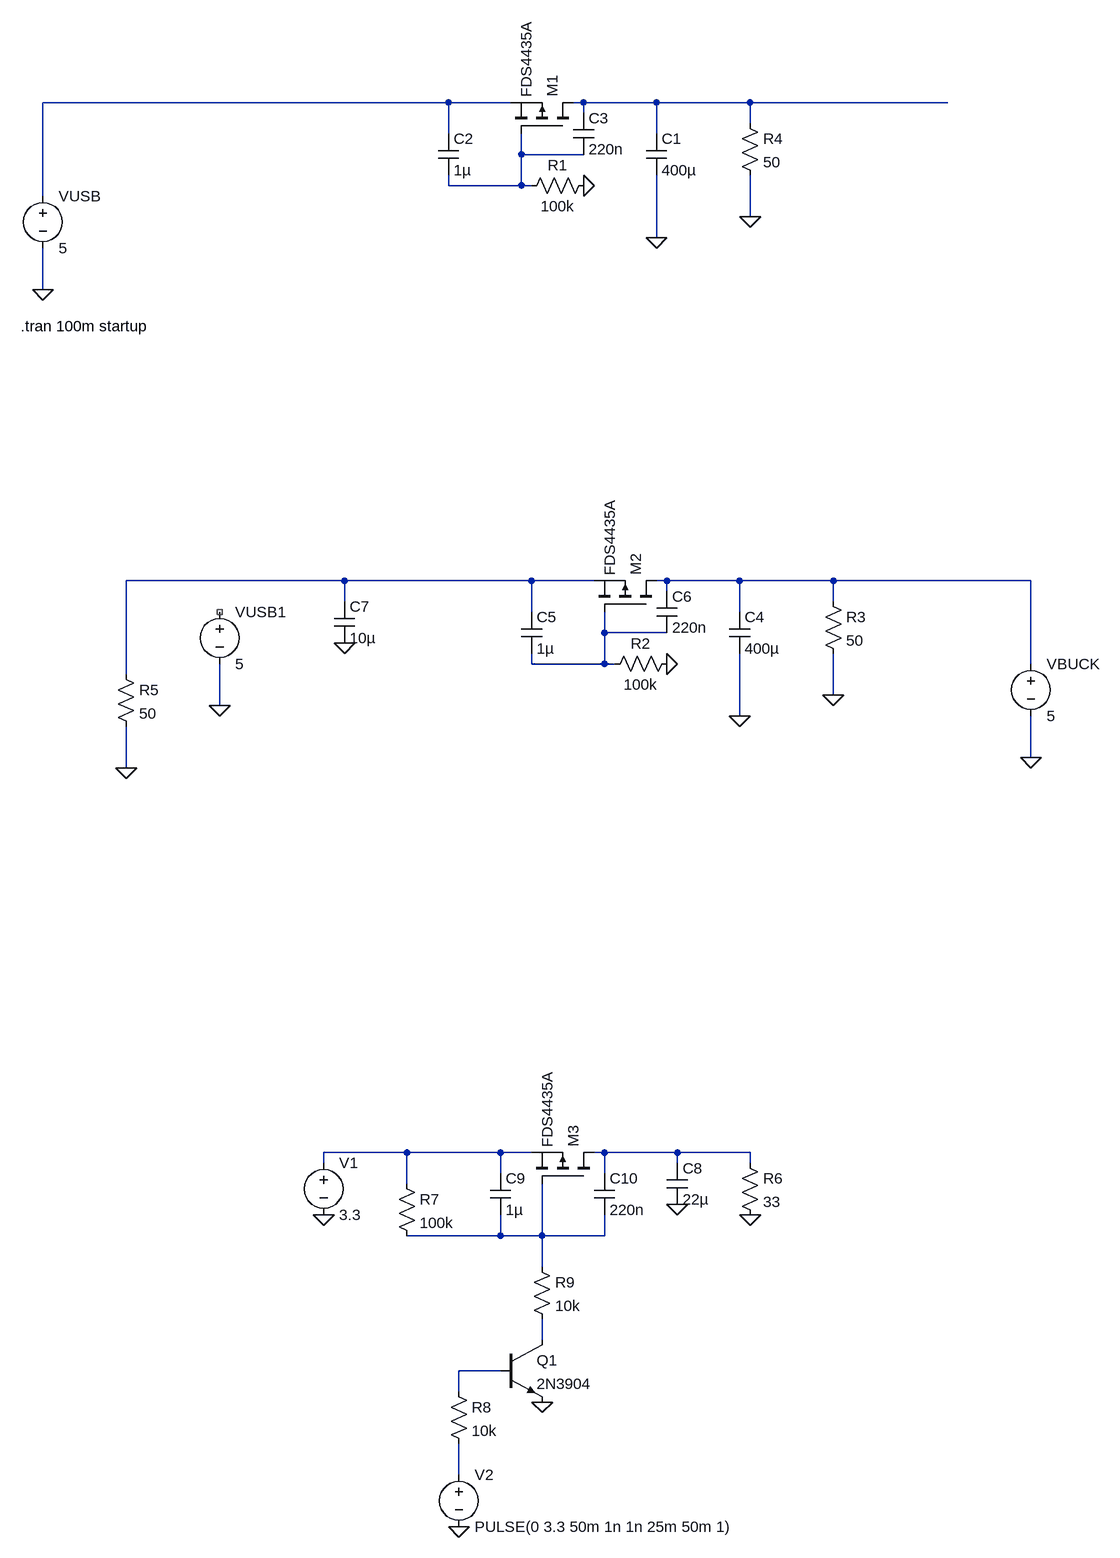
[diagram p0: schematic FMU_Inrush_Switches.asc]
FMU_Inrush_Switches.asc, the LTspice schematic file:
Version 4
SHEET 1 1056 2420
WIRE 48 208 -576 208
WIRE 144 208 48 208
WIRE 256 208 240 208
WIRE 368 208 256 208
WIRE 512 208 368 208
WIRE 816 208 512 208
WIRE 256 224 256 208
WIRE 512 240 512 208
WIRE 48 256 48 208
WIRE 368 256 368 208
WIRE 160 288 160 256
WIRE 256 288 160 288
WIRE 48 336 48 320
WIRE 160 336 160 288
WIRE 160 336 48 336
WIRE 176 336 160 336
WIRE -576 352 -576 208
WIRE 512 384 512 320
WIRE 368 416 368 320
WIRE -576 496 -576 432
WIRE -112 944 -448 944
WIRE 176 944 -112 944
WIRE 272 944 176 944
WIRE 384 944 368 944
WIRE 496 944 384 944
WIRE 640 944 496 944
WIRE 944 944 640 944
WIRE 384 960 384 944
WIRE -112 976 -112 944
WIRE 640 976 640 944
WIRE 176 992 176 944
WIRE 496 992 496 944
WIRE 288 1024 288 992
WIRE 384 1024 288 1024
WIRE 176 1072 176 1056
WIRE 288 1072 288 1024
WIRE 288 1072 176 1072
WIRE 304 1072 288 1072
WIRE 944 1072 944 944
WIRE -448 1088 -448 944
WIRE 640 1120 640 1056
WIRE -304 1136 -304 1072
WIRE 496 1152 496 1056
WIRE 944 1216 944 1152
WIRE -448 1232 -448 1168
WIRE -16 1824 -144 1824
WIRE 128 1824 -16 1824
WIRE 176 1824 128 1824
WIRE 288 1824 272 1824
WIRE 400 1824 288 1824
WIRE 512 1824 400 1824
WIRE -144 1840 -144 1824
WIRE 400 1840 400 1824
WIRE 512 1840 512 1824
WIRE 128 1856 128 1824
WIRE 288 1856 288 1824
WIRE -16 1872 -16 1824
WIRE 128 1952 128 1920
WIRE 128 1952 -16 1952
WIRE 192 1952 192 1872
WIRE 192 1952 128 1952
WIRE 288 1952 288 1920
WIRE 288 1952 192 1952
WIRE 192 2000 192 1952
WIRE 192 2112 192 2080
WIRE 128 2160 64 2160
WIRE 64 2192 64 2160
WIRE 64 2320 64 2272
FLAG -576 496 0
FLAG 944 1216 0
FLAG 368 416 0
FLAG 512 384 0
FLAG 256 336 0
FLAG -448 1232 0
FLAG 496 1152 0
FLAG 640 1120 0
FLAG 384 1072 0
FLAG -112 1040 0
FLAG 400 1904 0
FLAG 512 1920 0
FLAG 192 2208 0
FLAG -144 1920 0
FLAG 64 2400 0
FLAG -304 1136 0
SYMBOL pmos 240 256 M270
SYMATTR InstName M1
SYMATTR Value FDS4435A
SYMBOL voltage -576 336 R0
SYMATTR InstName VUSB
SYMATTR Value 5
SYMBOL voltage 944 1056 R0
SYMATTR InstName VBUCK
SYMATTR Value 5
SYMBOL cap 352 256 R0
SYMATTR InstName C1
SYMATTR Value 400µ
SYMBOL res 272 320 R90
WINDOW 0 0 56 VBottom 2
WINDOW 3 32 56 VTop 2
SYMATTR InstName R1
SYMATTR Value 100k
SYMBOL cap 32 256 R0
SYMATTR InstName C2
SYMATTR Value 1µ
SYMBOL res 496 224 R0
SYMATTR InstName R4
SYMATTR Value 50
SYMBOL cap 240 224 R0
SYMATTR InstName C3
SYMATTR Value 220n
SYMBOL pmos 368 992 M270
SYMATTR InstName M2
SYMATTR Value FDS4435A
SYMBOL cap 480 992 R0
SYMATTR InstName C4
SYMATTR Value 400µ
SYMBOL res 400 1056 R90
WINDOW 0 0 56 VBottom 2
WINDOW 3 32 56 VTop 2
SYMATTR InstName R2
SYMATTR Value 100k
SYMBOL cap 160 992 R0
SYMATTR InstName C5
SYMATTR Value 1µ
SYMBOL res 624 960 R0
SYMATTR InstName R3
SYMATTR Value 50
SYMBOL cap 368 960 R0
SYMATTR InstName C6
SYMATTR Value 220n
SYMBOL cap -128 976 R0
SYMATTR InstName C7
SYMATTR Value 10µ
SYMBOL res -464 1072 R0
SYMATTR InstName R5
SYMATTR Value 50
SYMBOL pmos 272 1872 M270
SYMATTR InstName M3
SYMATTR Value FDS4435A
SYMBOL cap 384 1840 R0
SYMATTR InstName C8
SYMATTR Value 22µ
SYMBOL res 496 1824 R0
SYMATTR InstName R6
SYMATTR Value 33
SYMBOL voltage -144 1824 R0
SYMATTR InstName V1
SYMATTR Value 3.3
SYMBOL voltage 64 2304 R0
WINDOW 123 0 0 Left 0
WINDOW 39 0 0 Left 0
SYMATTR InstName V2
SYMATTR Value PULSE(0 3.3 50m 1n 1n 25m 50m 1)
SYMBOL res -32 1856 R0
SYMATTR InstName R7
SYMATTR Value 100k
SYMBOL npn 128 2112 R0
SYMATTR InstName Q1
SYMATTR Value 2N3904
SYMBOL res 48 2176 R0
SYMATTR InstName R8
SYMATTR Value 10k
SYMBOL cap 112 1856 R0
SYMATTR InstName C9
SYMATTR Value 1µ
SYMBOL res 176 1984 R0
SYMATTR InstName R9
SYMATTR Value 10k
SYMBOL cap 272 1856 R0
SYMATTR InstName C10
SYMATTR Value 220n
SYMBOL voltage -304 976 R0
SYMATTR InstName VUSB1
SYMATTR Value 5
TEXT -610 552 Left 2 !.tran 100m startup

The netlist it stands for:
* FMU_Inrush_Switches.asc
M1 N002 N003 N001 N001 FDS4435A
VUSB N001 0 5
VBUCK N005 0 5
C1 N002 0 400µ
R1 0 N003 100k
C2 N001 N003 1µ
R4 N002 0 50
C3 N002 N003 220n
M2 N005 N006 N004 N004 FDS4435A
C4 N005 0 400µ
R2 0 N006 100k
C5 N004 N006 1µ
R3 N005 0 50
C6 N005 N006 220n
C7 N004 0 10µ
R5 N004 0 50
M3 N008 N009 N007 N007 FDS4435A
C8 N008 0 22µ
R6 N008 0 33
V1 N007 0 3.3
V2 N012 0 PULSE(0 3.3 50m 1n 1n 25m 50m 1)
R7 N007 N009 100k
Q1 N010 N011 0 0 2N3904
R8 N011 N012 10k
C9 N007 N009 1µ
R9 N009 N010 10k
C10 N008 N009 220n
VUSB1 NC_01 0 5
.model NPN NPN
.model PNP PNP
.lib standard.bjt
.model NMOS NMOS
.model PMOS PMOS
.lib standard.mos
.tran 100m startup
.backanno
.end